# Altium project plp-ctop_3a.PrjPcb
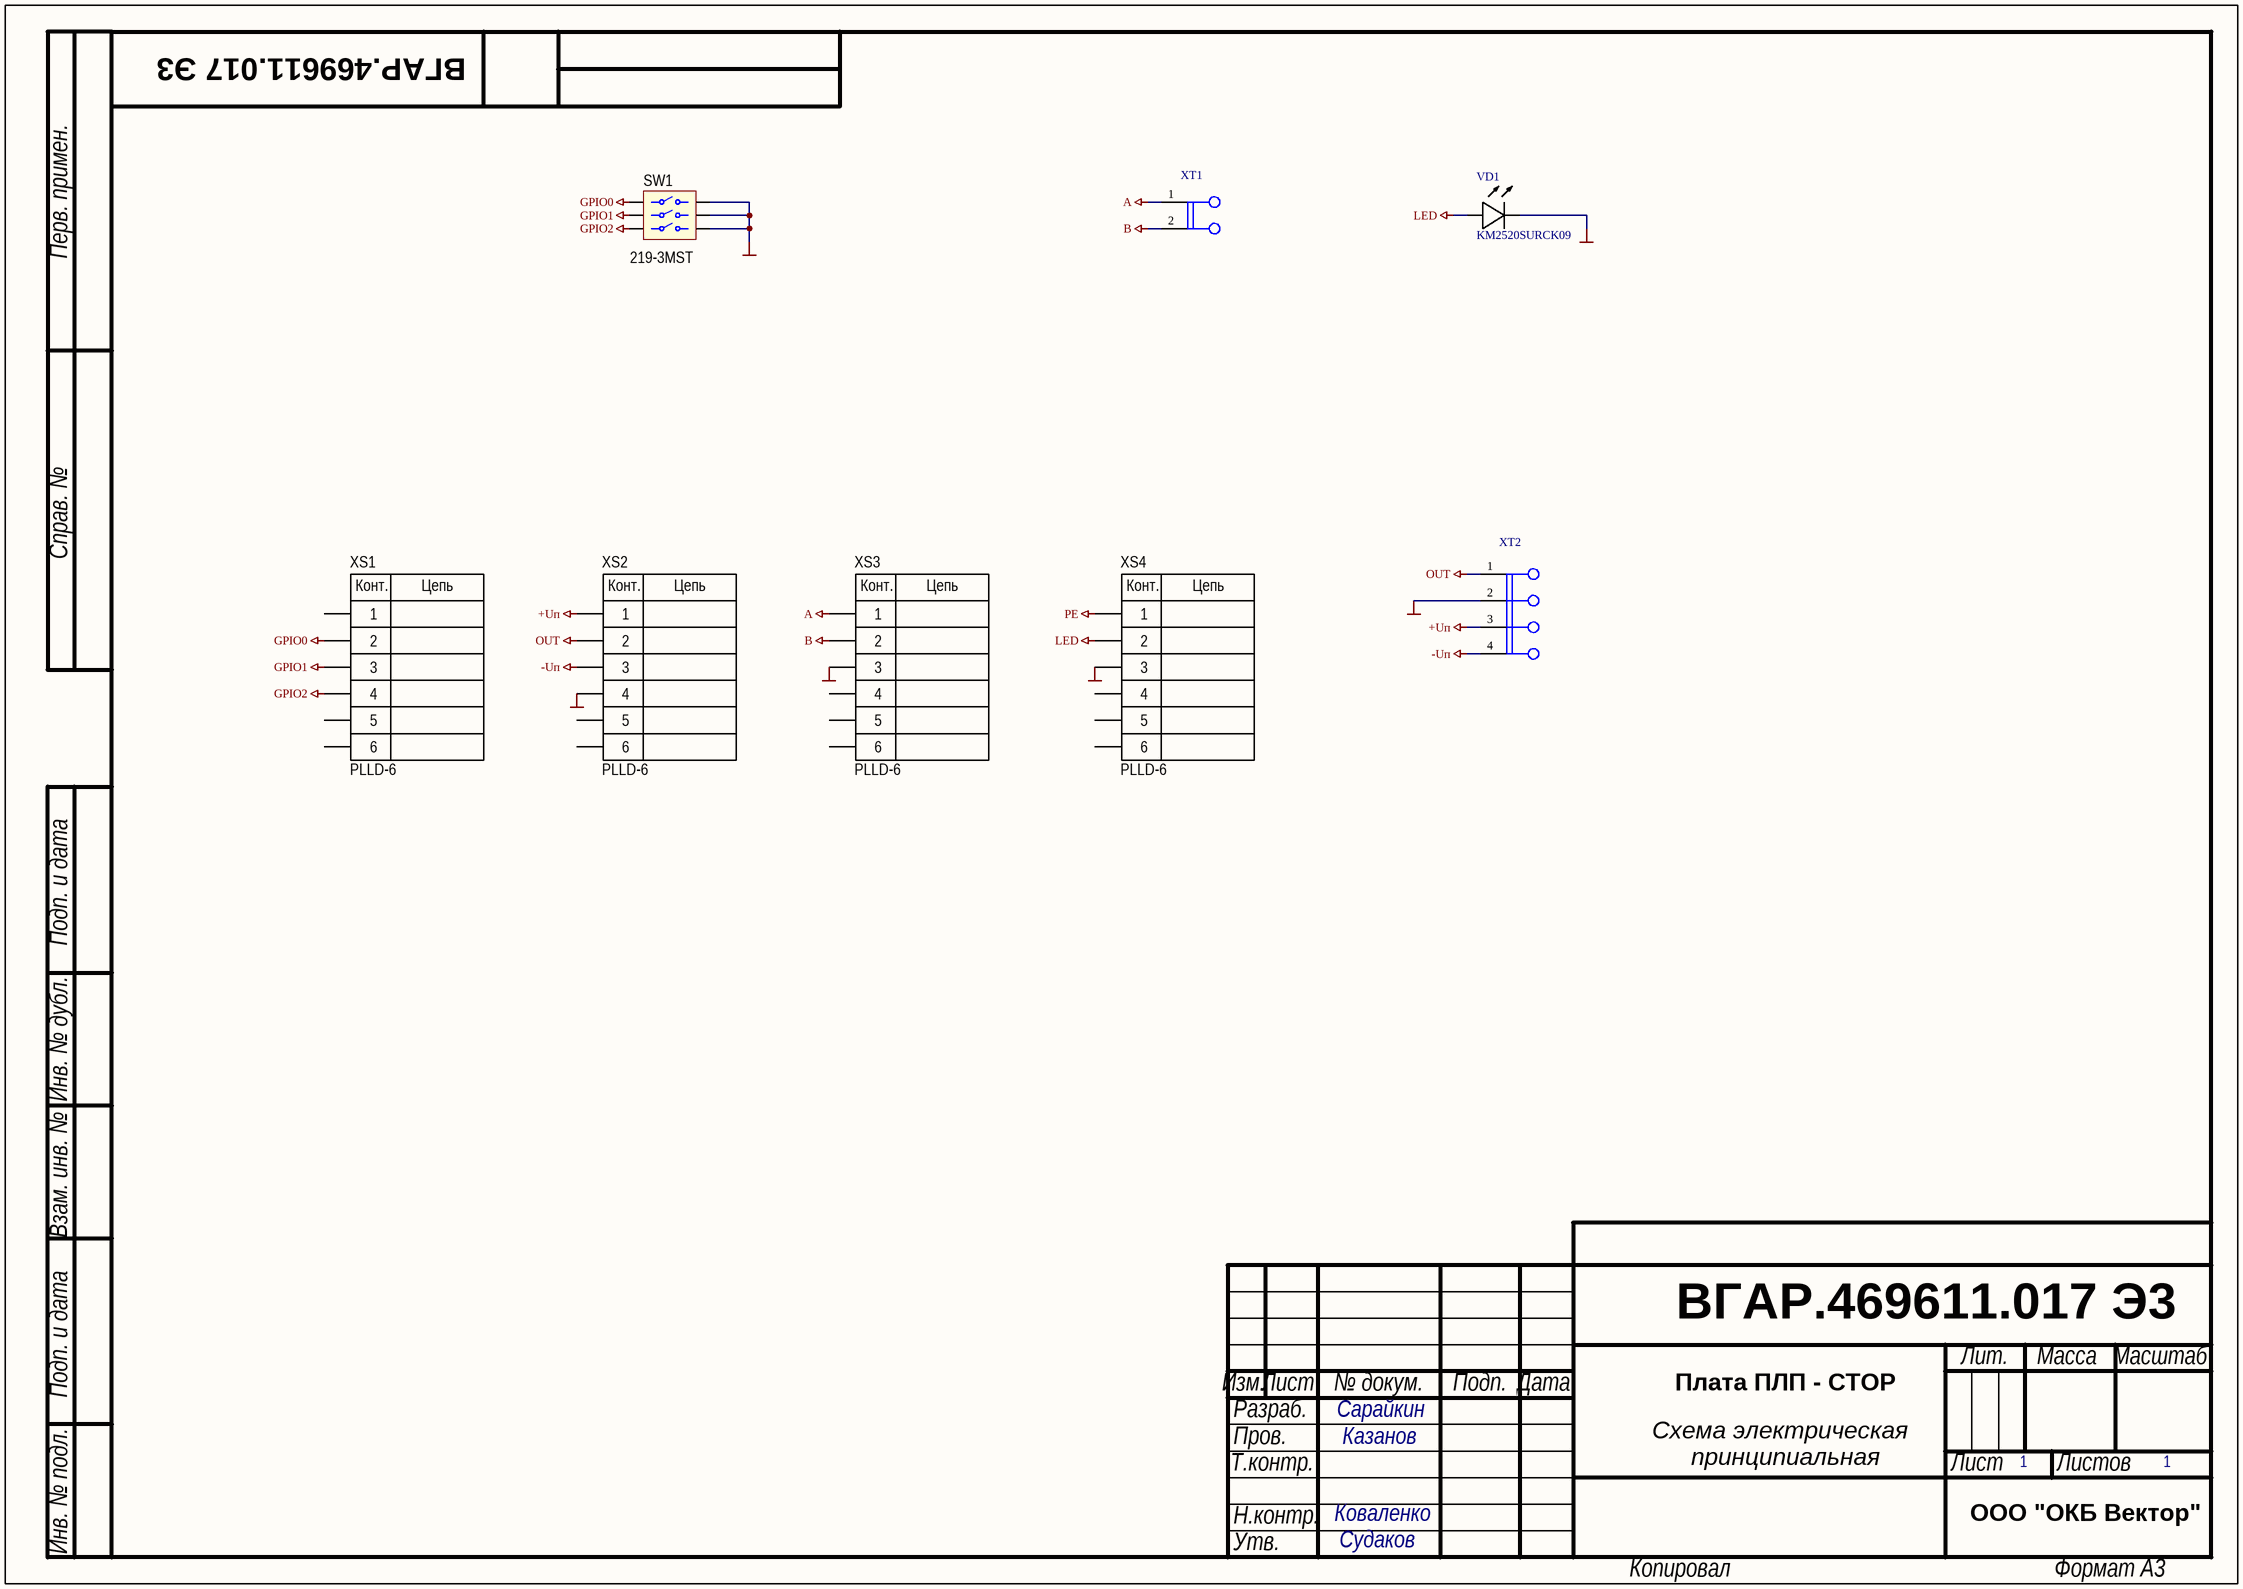
[diagram p0: plp-ctop_3a.SchDoc]
1 sheet, 8 parts. Net scope: global (net labels, ports and power ports of the same name join across sheets).
Board file: plp-ctop_3a.PcbDoc

## Sheet plp-ctop_3a.SchDoc
size 420 x 297 mm; PageSetup: Record=PageOptions|CenterHorizontal=False|CenterVertical=False|PrintScale=0.96|XCorrection=0.00|YCorrection=0.00|PrintKind=1|BorderSize=5000000|LeftOffset=0|BottomOffset=0|Orientation=2|PaperLength=4200|PaperWidth=2970|Scale=100|PaperSource=7|PrintQuality=600|MediaType=1|DitherType=10|PaperKind=A3|PrintScaleMode=1; Rule: PcbType=ProtelPcb

### Parts
SW1  219-3MST  [219-3MST]
VD1  KM2520SURCK09  [KM2520SURCK09]
XS1  PLLD-6  [CON: PLL-6(2x3R1.27female)]
XS2  PLLD-6  [CON: PLL-6(2x3R1.27female)]
XS3  PLLD-6  [CON: PLL-6(2x3R1.27female)]
XS4  PLLD-6  [CON: PLL-6(2x3R1.27female)]
XT1  MKDS 1/2 - 3,5  [MKDS 1/2 - 3,5]  (value not drawn)
XT2  MKDS 1/4 - 3,5  [MKDS 1/4 - 3,5]  (value not drawn)

### Nets
+Uп: XS2.1 XT2.3
-Uп: XS2.3 XT2.4
A: XS3.1 XT1.1
B: XS3.2 XT1.2
GND: SW1.4 SW1.5 SW1.6 VD1.2(K) XS2.4 XS3.3 XS4.3 XT2.2
GPIO0: SW1.1 XS1.2
GPIO1: SW1.2 XS1.3
GPIO2: SW1.3 XS1.4
LED: VD1.1(A) XS4.2
OUT: XS2.2 XT2.1
PE: XS4.1

Not connected (* = marked no-connect by the designer): XS1 1 5 6; XS2 5 6; XS3 4 5 6; XS4 4 5 6

### Notes on the sheet
- ВГАР.469611.017 Э3
- Плата ПЛП - CTOP
- Сарайкин
- Казанов
- Схема электрическая
- принципиальная
- 1
- Коваленко
- ООО "ОКБ Вектор"
- Судаков
- Перв. примен.
- Справ. №
- Подп. и дата
- Инв. № дубл.
- Взам. инв. №
- Изм.
- Лист
- № докум.
- Подп.
- Дата
- Лит.
- Масса
- Масштаб
- Т.контр.
- Пров.
- Разраб.
- Листов
- Инв. № подл.
- Н.контр.
- Утв.
- Копировал
- Формат А3
- (in symbol PLLD-6(Female)) Конт.; Цепь

### Library data of the parts
VD1 = KM2520SURCK09: LED
XS1-XS4 = PLLD-6(Female): Step 1.27
XT1 = MKDS 1/2 - 3,5: Клемник; Manufacturer: Poenix Contact; OrderCode: 1751248; Color: green; ComponentLink1Description: Data Sheet; ComponentLink1URL: http://eshop.phoenixcontact.de/phoenix/treeViewClick.do?UID=1725656&parentUID=852628134&reloadFrame=true
XT2 = MKDS 1/4 - 3,5: Клемник; Manufacturer: Poenix Contact; OrderCode: 1751264; Color: green; ComponentLink1Description: Data Sheet; ComponentLink1URL: http://eshop.phoenixcontact.de/phoenix/treeViewClick.do?UID=1725656&parentUID=852628134&reloadFrame=true